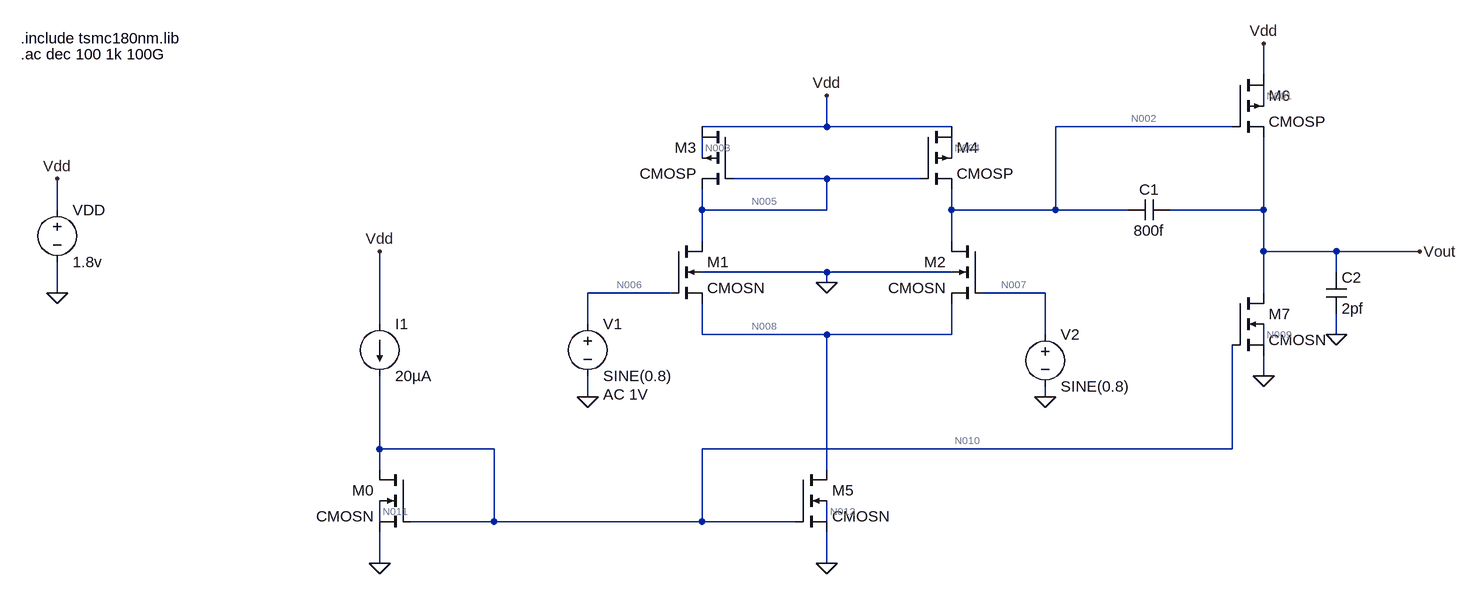
[diagram p0: schematic 2 stage opamp.asc]
2 stage opamp.asc, the LTspice schematic file:
Version 4.1
SHEET 1 2504 1112
WIRE 2192 320 2192 272
WIRE 2192 368 2192 336
WIRE 1520 400 1520 352
WIRE 1520 400 1328 400
WIRE 1712 400 1520 400
WIRE 2144 400 1872 400
WIRE 1328 448 1328 416
WIRE 1712 448 1712 416
WIRE 1520 480 1376 480
WIRE 1664 480 1520 480
WIRE 336 528 336 480
WIRE 1328 528 1328 496
WIRE 1520 528 1520 480
WIRE 1520 528 1328 528
WIRE 1712 528 1712 496
WIRE 1872 528 1872 400
WIRE 1872 528 1712 528
WIRE 1984 528 1872 528
WIRE 2192 528 2192 416
WIRE 2192 528 2048 528
WIRE 1328 576 1328 528
WIRE 1712 576 1712 528
WIRE 2192 592 2192 528
WIRE 2304 592 2192 592
WIRE 2432 592 2304 592
WIRE 1520 624 1328 624
WIRE 1712 624 1520 624
WIRE 2304 624 2304 592
WIRE 1520 640 1520 624
WIRE 336 656 336 608
WIRE 1280 656 1152 656
WIRE 1856 656 1760 656
WIRE 2192 656 2192 592
WIRE 832 704 832 592
WIRE 1152 704 1152 656
WIRE 1328 720 1328 672
WIRE 1520 720 1328 720
WIRE 1712 720 1712 672
WIRE 1712 720 1520 720
WIRE 1856 720 1856 656
WIRE 2304 720 2304 688
WIRE 2192 736 2192 704
WIRE 2192 784 2192 752
WIRE 1152 816 1152 784
WIRE 1856 816 1856 800
WIRE 832 896 832 784
WIRE 1008 896 832 896
WIRE 2144 896 2144 736
WIRE 2144 896 1328 896
WIRE 832 928 832 896
WIRE 1520 928 1520 720
WIRE 832 1008 832 976
WIRE 1008 1008 1008 896
WIRE 1008 1008 880 1008
WIRE 1328 1008 1328 896
WIRE 1328 1008 1008 1008
WIRE 1472 1008 1328 1008
WIRE 1520 1008 1520 976
WIRE 832 1072 832 1024
WIRE 1520 1072 1520 1024
FLAG 336 656 0
FLAG 336 480 Vdd
FLAG 1520 352 Vdd
FLAG 1152 816 0
FLAG 1856 816 0
FLAG 832 592 Vdd
FLAG 832 1072 0
FLAG 1520 1072 0
FLAG 2192 784 0
FLAG 2304 720 0
FLAG 2432 592 Vout
FLAG 2192 272 Vdd
FLAG 1520 640 0
DATAFLAG 1520 480 ""
DATAFLAG 1520 720 ""
DATAFLAG 1232 1008 ""
DATAFLAG 1440 528 ""
DATAFLAG 1792 528 ""
DATAFLAG 944 896 ""
DATAFLAG 1392 896 ""
DATAFLAG 2000 400 ""
DATAFLAG 2192 304 ""
DATAFLAG 2192 512 ""
DATAFLAG 2144 832 ""
SYMBOL voltage 336 512 R0
WINDOW 123 0 0 Left 0
WINDOW 39 0 0 Left 0
SYMATTR InstName VDD
SYMATTR Value 1.8v
SYMBOL cmosp 1376 400 M0
SYMATTR InstName M3
SYMATTR Value2 l=500n w=4.75u
SYMBOL cmosp 1664 400 R0
SYMATTR InstName M4
SYMATTR Value2 l=500n w=4.75u
SYMBOL cmosn 1280 576 R0
SYMATTR InstName M1
SYMATTR Value2 l=500n w=3.09u
SYMBOL cmosn 1760 576 M0
SYMATTR InstName M2
SYMATTR Value2 l=500n w=3.09u
SYMBOL voltage 1152 688 R0
WINDOW 123 24 124 Left 2
WINDOW 39 0 0 Left 0
SYMATTR Value2 AC 1V
SYMATTR InstName V1
SYMATTR Value SINE(0.8)
SYMBOL voltage 1856 704 R0
WINDOW 123 24 124 Left 2
WINDOW 39 0 0 Left 0
SYMATTR InstName V2
SYMATTR Value SINE(0.8)
SYMBOL cmosn 880 928 M0
SYMATTR InstName M0
SYMATTR Value2 l=500n w=2.85u
SYMBOL cmosn 1472 928 R0
SYMATTR InstName M5
SYMATTR Value2 l=500n w=2.85u
SYMBOL current 832 704 R0
SYMATTR InstName I1
SYMATTR Value 20µA
SYMBOL cap 2048 512 R90
WINDOW 0 0 32 VBottom 2
WINDOW 3 32 32 VTop 2
SYMATTR InstName C1
SYMATTR Value 800f
SYMBOL cmosp 2144 320 R0
SYMATTR InstName M6
SYMATTR Value2 l=500n w=63u
SYMBOL cmosn 2144 656 R0
SYMATTR InstName M7
SYMATTR Value2 l=500n w=20u
SYMBOL cap 2288 624 R0
SYMATTR InstName C2
SYMATTR Value 2pf
TEXT 280 264 Left 2 !.include tsmc180nm.lib
TEXT 280 288 Left 2 !.ac dec 100 1k 100G

The netlist it stands for:
* 2 stage opamp.asc
VDD Vdd 0 1.8v
M3 Vdd N005 N005 N003 CMOSP l=500n w=4.75u
M4 Vdd N005 N002 N004 CMOSP l=500n w=4.75u
M1 N005 N006 N008 0 CMOSN l=500n w=3.09u
M2 N002 N007 N008 0 CMOSN l=500n w=3.09u
V1 N006 0 SINE(0.8) AC 1V
V2 N007 0 SINE(0.8)
M0 N010 N010 0 N011 CMOSN l=500n w=2.85u
M5 N008 N010 0 N012 CMOSN l=500n w=2.85u
I1 Vdd N010 20µA
C1 Vout N002 800f
M6 Vdd N002 Vout N001 CMOSP l=500n w=63u
M7 Vout N010 0 N009 CMOSN l=500n w=20u
C2 Vout 0 2pf
.model NMOS NMOS
.model PMOS PMOS
.lib standard.mos
.include tsmc180nm.lib
.ac dec 100 1k 100G
.backanno
.end

* Results of the author's LTspice run, read from the files saved beside the schematic
* Operating Point, zero values left out:
*   V(n005) = 1.24 V
*   V(n002) = 1.24 V
*   V(n004) = 1.663 V
*   V(n008) = 210 mV
*   V(n011) = 90.5 mV
*   V(vout) = 321.7 mV
*   V(n001) = 1.654 V
*   V(vdd) = 1.8 V
*   V(n003) = 1.663 V
*   V(n006) = 800 mV
*   V(n007) = 800 mV
*   V(n010) = 582.4 mV
*   V(n012) = 51.89 mV
*   V(n009) = 67.89 mV
*   I(VDD) = -158.9 µA
*   Id(M4) = 8.243 µA
*   Is(M4) = -8.243 µA
*   Ib(M4) = -1.663 pA
*   Id(M0) = 20 µA
*   Is(M0) = -20 µA
*   Id(M7) = 122.4 µA
*   Is(M7) = -122.4 µA
*   Id(M2) = 8.243 µA
*   Is(M2) = -8.243 µA
*   Ib(M2) = -1.47 pA
*   Id(M1) = 8.243 µA
*   Is(M1) = -8.243 µA
*   Ib(M1) = -1.47 pA
*   Id(M5) = 16.49 µA
*   Is(M5) = -16.49 µA
*   I(I1) = 20 µA
*   Id(M6) = 122.4 µA
*   Is(M6) = -122.4 µA
*   Ib(M6) = -1.654 pA
*   Id(M3) = 8.243 µA
*   Is(M3) = -8.243 µA
*   Ib(M3) = -1.663 pA
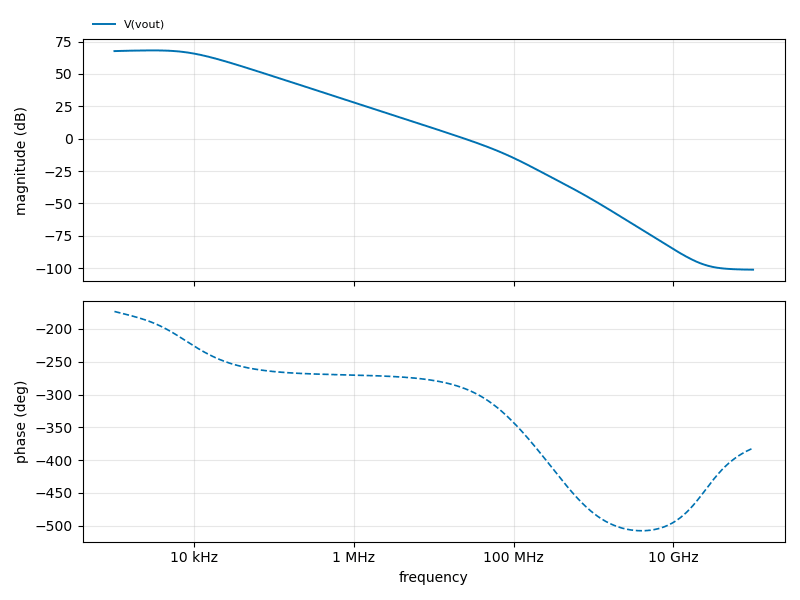
[diagram p1: AC Analysis of 2 stage opamp.asc, plotted from the saved traces]
* AC Analysis, 1 run:
*   V(vout): 67.65 dB at 1 kHz, -101.22 dB at 100 GHz, peak 68.18 dB at 3.02 kHz, 3 dB below the peak at 11.05 kHz